# Altium schematic sheet LoRaE5.SchDoc
size A; SheetNumber: 1; SheetTotal: 6
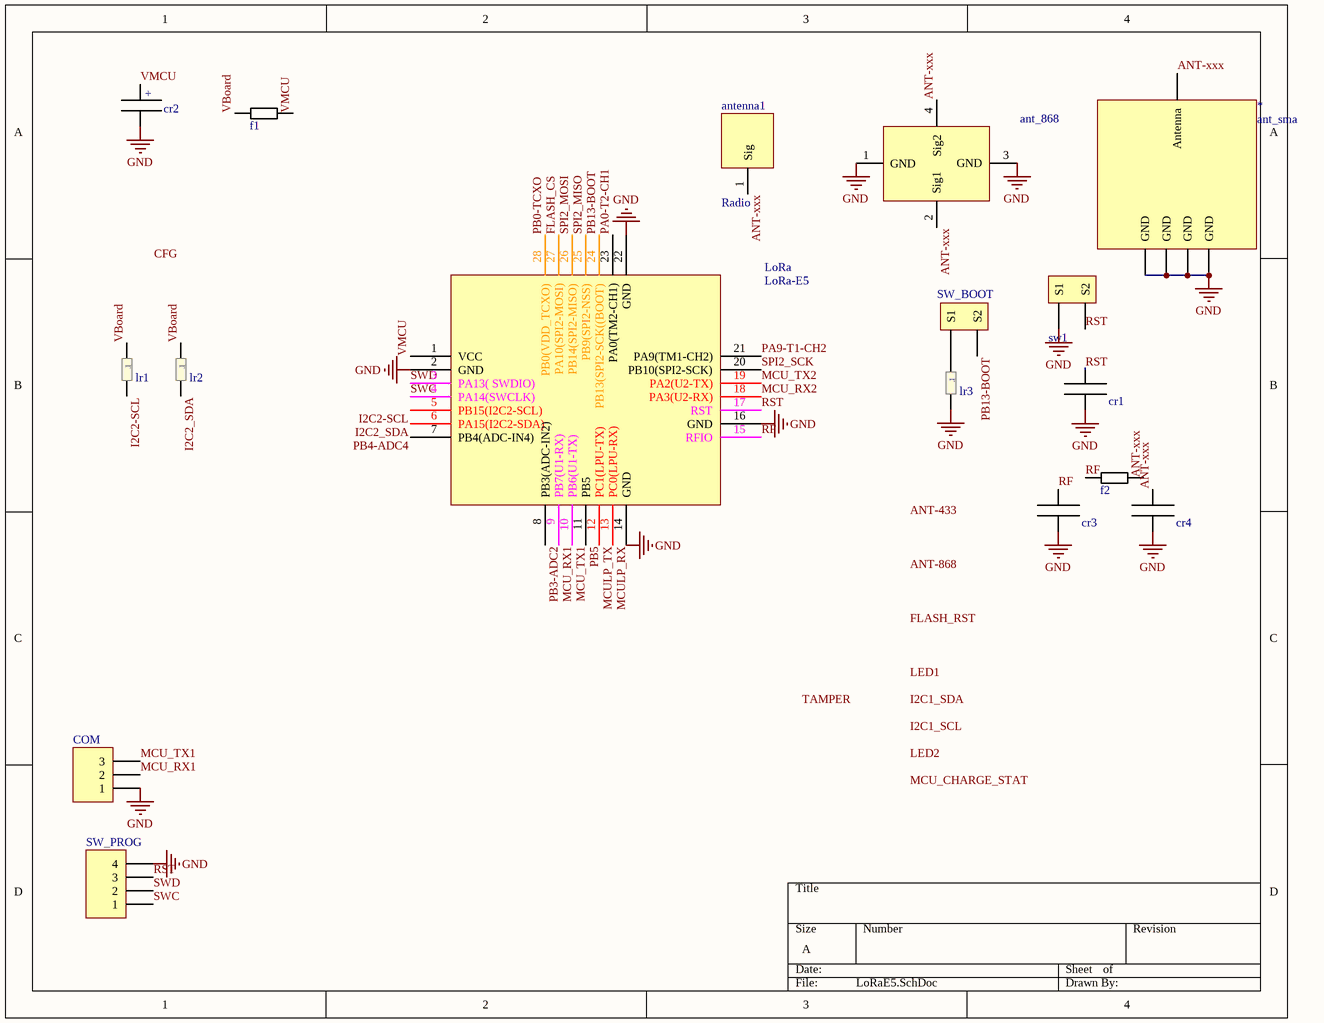
[diagram p0: LoRaE5.SchDoc]

## Parts
*  ant_sma  [abr_sma_r_3d]
ant_868  Radio  [abr_ant_ufl_smd_3d]  (value not drawn)
antenna1  Radio  [abr_ant_hole_smd_2d]
COM  Header 3  [HDR1X3]  (value not drawn)
cr1  100nf  [abr_cap_0805_3d]  (value not drawn)
cr2  10uf  [abr_cap_d_3d]  (value not drawn)
cr3  100nf  [abr_cap_0805_3d]  (value not drawn)
cr4  100nf  [abr_cap_0805_3d]  (value not drawn)
f1  smd-0805  [abr_fer_0805_3d]  (value not drawn)
f2  smd-0805  [abr_fer_0805_3d]  (value not drawn)
LoRa  LoRa-E5  [abr_lora_e5_hf_3d]
lr1  100k  [abr_res_0805_3d]  (value not drawn)
lr2  100k  [abr_res_0805_3d]  (value not drawn)
lr3  470R  [abr_res_0805_3d]  (value not drawn)
sw1  switch  [abr_sw_tact_3d]  (value not drawn)
SW_BOOT  switch  [abr_sw_tact_3d]  (value not drawn)
SW_PROG  Header 4  [HDR1X4]  (value not drawn)

## Nets
GND: *.2(GND) *.3(GND) *.4(GND) *.5(GND) ant_868.1(GND) ant_868.3(GND) COM.1 cr1.0 cr2.1 cr3.0 cr4.0 LoRa.2(GND) LoRa.14(GND) LoRa.16(GND) LoRa.22(GND) lr3.1 sw1.1(S1) SW_PROG.4
ANT-xxx: *.1(Antenna) ant_868.2(Sig1) ant_868.4(Sig2) antenna1.1(Sig) cr4.1 f2.1
FLASH_CS: LoRa.27(PA10(SPI2-MOSI))
I2C2-SCL: LoRa.5(PB15(I2C2-SCL)) lr1.1
I2C2_SDA: LoRa.6(PA15(I2C2-SDA)) lr2.1
MCU_RX1: COM.2 LoRa.9(PB7(U1-RX))
MCU_RX2: LoRa.18(PA3(U2-RX))
MCU_TX1: COM.3 LoRa.10(PB6(U1-TX))
MCU_TX2: LoRa.19(PA2(U2-TX))
MCULP_RX: LoRa.13(PC0(LPU-RX))
MCULP_TX: LoRa.12(PC1(LPU-TX))
PA0-T2-CH1: LoRa.23(PA0(TM2-CH1))
PA9-T1-CH2: LoRa.21(PA9(TM1-CH2))
PB0-TCXO: LoRa.28(PB0(VDD_TCXO))
PB3-ADC2: LoRa.8(PB3(ADC-IN2))
PB4-ADC4: LoRa.7(PB4(ADC-IN4))
PB5: LoRa.11(PB5)
PB13-BOOT: LoRa.24(PB13(SPI2-SCK((BOOT)) SW_BOOT.2(S2)
RF: cr3.1 f2.0 LoRa.15(RFIO)
RST: cr1.1 LoRa.17(RST) sw1.2(S2) SW_PROG.3
SPI2_MISO: LoRa.25(PB9(SPI2-NSS))
SPI2_MOSI: LoRa.26(PB14(SPI2-MISO))
SPI2_SCK: LoRa.20(PB10(SPI2-SCK))
SWC: LoRa.4(PA14(SWCLK)) SW_PROG.1
SWD: LoRa.3(PA13(_SWDIO)) SW_PROG.2
VBoard: f1.0 lr1.0 lr2.0
VMCU: cr2.0(+) f1.1 LoRa.1(VCC)
Netlr3_0: lr3.0 SW_BOOT.1(S1)

## Notes on the sheet
- Labels drawn without touching a wire or pin: ANT-433, ANT-868, CFG, FLASH_RST, I2C1_SCL, I2C1_SDA, LED1, LED2, MCU_CHARGE_STAT, TAMPER
- (in symbol abr_res_0805) r

## Library data of the parts
* = abr_sma_s_r
ant_868 = abr_ant_ufl
antenna1 = abr_anthole
COM = Header 3: Header, 3-Pin; LatestRevisionDate: 17-Jul-2002; LatestRevisionNote: Re-released for DXP Platform.; Publisher: Altium Limited
cr1 cr3 cr4 = abr_cap_0805
cr2 = abr_cap
f1 f2 = abr_fer_0805
lr1-lr3 = abr_res_0805
sw1 SW_BOOT = abr_switch_tact
SW_PROG = Header 4: Header, 4-Pin; LatestRevisionDate: 17-Jul-2002; LatestRevisionNote: Re-released for DXP Platform.; Publisher: Altium Limited